# EAGLE design X8-Navboard (EAGLE 7.5.0)
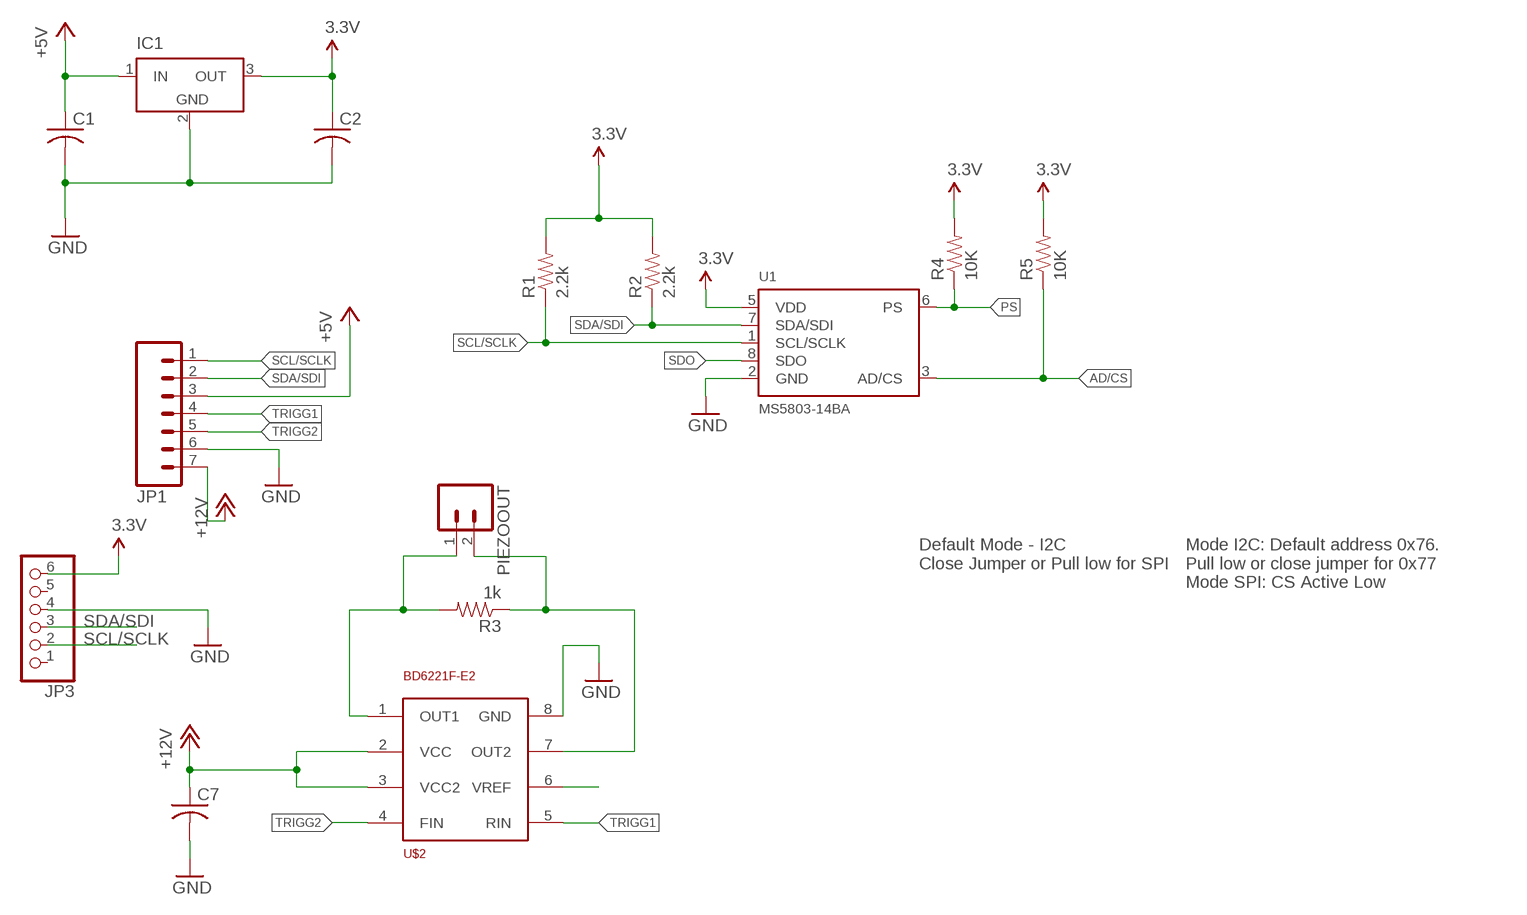
[diagram p0: schematic, sheet 1]

## Parts
C1  C-USC0603  [C0603]
C2  C-USC0603  [C0603]
C7  C-USC0603  [C0603]
IC1  LT1129CST5  [SOT223]
JP1  M07  [1X07]
JP3  PINHD-1X6  [1X06]
PIEZOOUT  M02LOCK_LONGPADS  [1X02_LOCK_LONGPADS]
R1  2.2k  2.2KOHM1/10W1%(0603)  [0603-RES]
R2  2.2k  2.2KOHM1/10W1%(0603)  [0603-RES]
R3  1k  2.2KOHM1/10W1%(0603)  [0603-RES]
R4  10K  10KOHM1/10W1%(0603)0603  [0603-RES]
R5  10K  10KOHM1/10W1%(0603)0603  [0603-RES]
U1  MS5803-14BA  [MS5803]
U$2  BD6221F-E2  [SOIC8]

## Nets
3.3V: C2.1 IC1.3(OUT) JP3.6 R1.2 R2.2 R4.2 R5.2 U1.5(VDD)
+5V: C1.1 IC1.1(IN) JP1.3
+12V: C7.1 JP1.7 U$2.2(VCC) U$2.3(VCC2)
AD/CS: R5.1 U1.3(AD/CS)
GND: C1.2 C2.2 C7.2 IC1.2(GND) JP1.6 JP3.4 U1.2(GND) U$2.8(GND)
N$1: PIEZOOUT.1 R3.2 U$2.1(OUT1)
N$2: PIEZOOUT.2 R3.1 U$2.7(OUT2)
N$9: U$2.6(VREF)
PS: R4.1 U1.6(PS)
SCL/SCLK: JP1.1 JP3.2 R1.1 U1.1(SCL/SCLK)
SDA/SDI: JP1.2 JP3.3 R2.1 U1.7(SDA/SDI)
SDO: U1.8(SDO)
TRIGG1: JP1.4 U$2.5(RIN)
TRIGG2: JP1.5 U$2.4(FIN)
Unconnected: JP3.1 JP3.5

## Notes on the sheet
- Default Mode - I2C
  Close Jumper or Pull low for SPI
- Mode I2C: Default address 0x76.
  Pull low or close jumper for 0x77
  Mode SPI: CS Active Low

## Power pins joined to a net without a drawn wire
GND: IC1.4(GND)

## Library data of the parts
C1 C2 C7 = resistor:C-US: CAPACITOR, American symbol
IC1 = linear-technology:LT1129CST5: VOLTAGE REGULATOR with shutdown; MPN: LT1129CST-5#PBF; OC_FARNELL: 1663375; OC_NEWARK: 57M2069
JP1 = SparkFun-Connectors:M07: Header 7 Standard 7-pin 0.1" header. Use with straight break away headers (SKU : PRT-00116), right angle break away headers (PRT-00553), swiss pins (PRT-00743), machine pins (PRT-00117), and female headers (PRT-00115). NOTES ON THE VARIANTS LOCK and LOCK_LONGPADS... This footprint was designed to help hold the alignment of a through-hole component (i.e. 7-pin header) while soldering it into place. You may notice that each hole has been shifted either up or down by 0.005 of an inch from it's more standard position (which is usually a perfectly straight line). This slight alteration caused the pins (the squares in the middle) to touch the edges of the holes. Because they are alternating, it causes a "brace" to hold the header in place. 0.005 has proven to be the perfect amount of "off-center" position when using our standard breakaway headers. Although looks a little odd when you look at the bare footprint, once you have a header in there, the alteration is very hard to notice. Also, if you push a header all the way into place, it is covered up entirely on the bottom side. This idea of altering the position of holes to aid alignment will be further integrated into the Sparkfun Library for other footprints. It can help hold any component with 3 or more connection pins.
JP3 = pinhead:PINHD-1X6: PIN HEADER
PIEZOOUT = SparkFun-Connectors:M02: Standard 2-pin 0.1" header. Use with - straight break away headers ( PRT-00116) - right angle break away headers (PRT-00553) - swiss pins (PRT-00743) - machine pins (PRT-00117) - female headers (PRT-00115) Molex polarized connector foot print use with: PRT-08233 with associated crimp pins and housings. 2.54_SCREWTERM for use with PRT-10571. 3.5mm Screw Terminal footprints for PRT-08084 5mm Screw Terminal footprints for use with PRT-08432
R1 R2 = SparkFun-Resistors:2.2KOHM1/10W1%(0603): RES-08272; PROD_ID: RES-08272
R3 = SparkFun-Resistors:2.2KOHM1/10W1%(0603): RES-08272; PROD_ID: RES-08272; VALUE: 2.2k
R4 R5 = SparkFun-Resistors:10KOHM1/10W1%(0603): RES-00824; PROD_ID: RES-00824
U1 = MS5803:MS5803-14BA; PROD_ID: IC-12111
U$2 = BNo-055:BD6221F-E2: IC MOTOR DRIVER Half Bridge

## Board
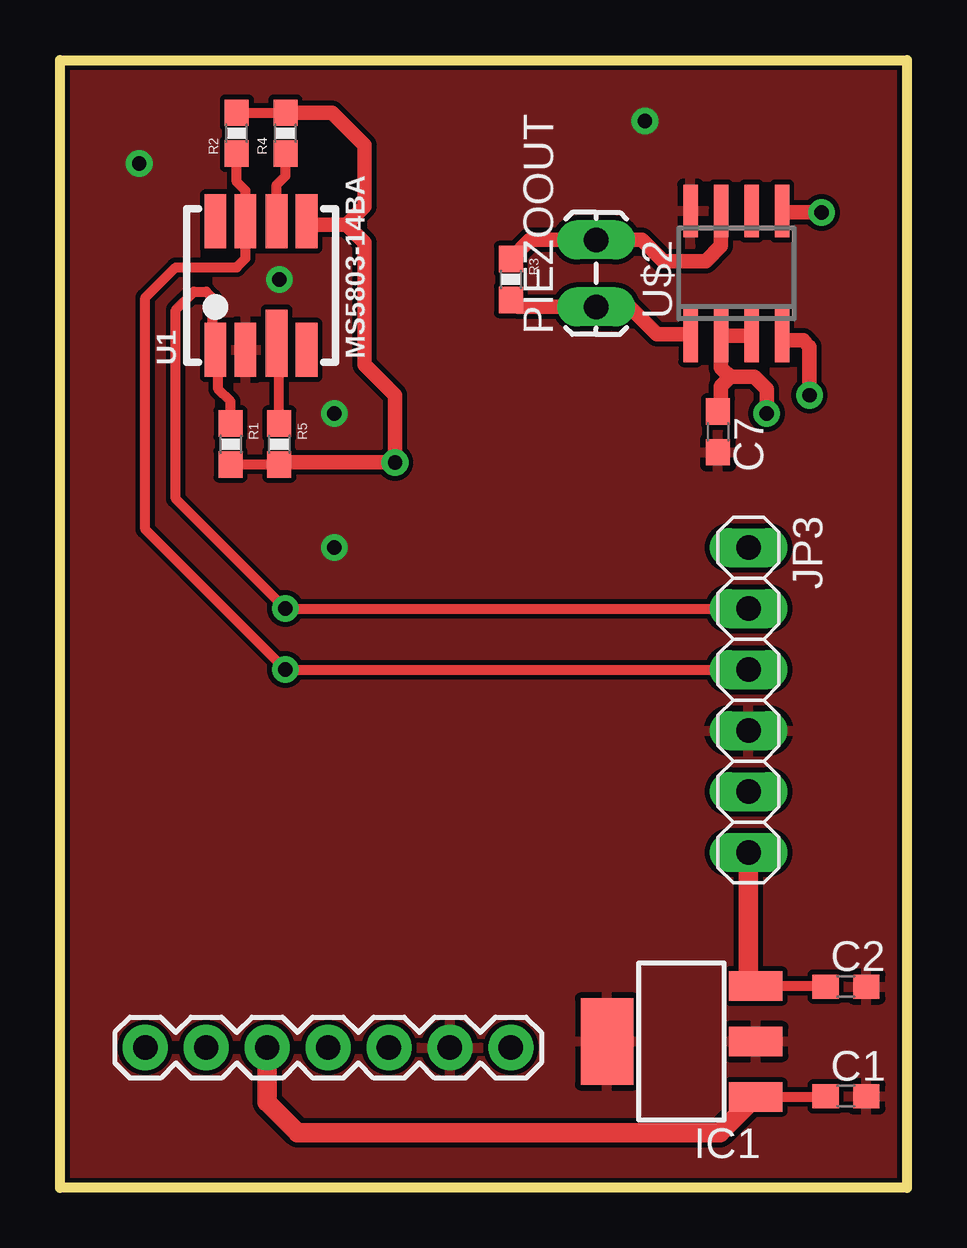
[diagram p1: board, top side]
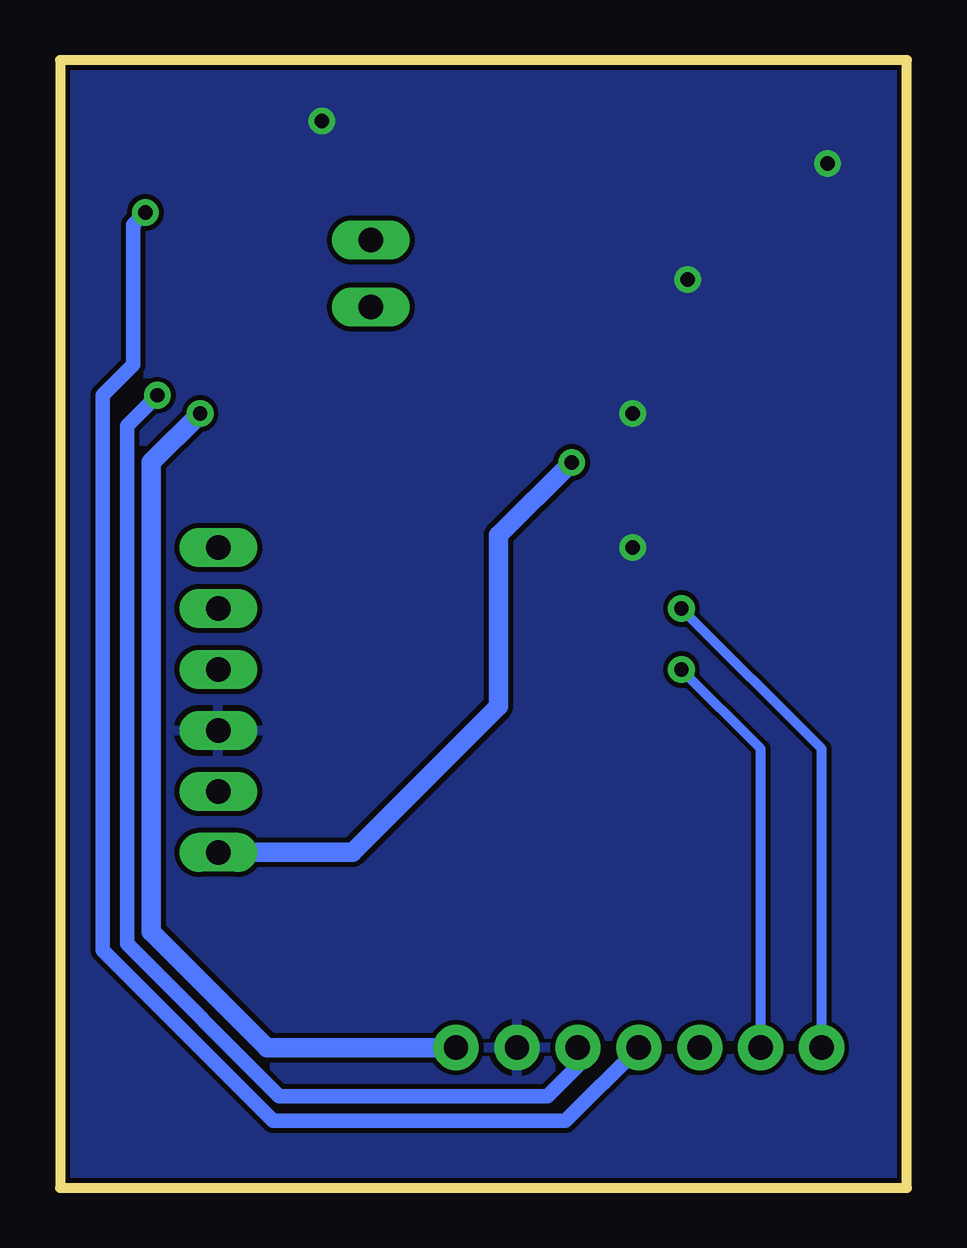
[diagram p2: board, bottom side, seen from below]

Size 35.31 x 46.99 mm. Coordinates in mm from the lower left corner, seen from the top.
Outline: 0,0 0,46.99 35.31,46.99 35.31,0 0,0
Copper layers (1*16): Top 0.035mm / dielectric 1.5mm / Bottom 0.035mm
Design rules "SparkFun-2-layer": minimum track width 7mil, minimum drill 15mil, track to track 8mil, track to pad 8mil, pad to pad 8mil, via to via 8mil, smd to smd 8mil, copper to edge 8mil, drill to drill 8mil, minimum pad ring 12mil, minimum via ring 10mil, stop-mask expansion 4mil, vias tented up to drill 20mil, thermal gap 10mil

### Footprints (pad centres in the part's own frame; a part is rotated, then mirrored left to right if it is on the bottom)
C0603 = smd 1.1 x 1: 1 -0.85,0; 2 0.85,0
SOT223 = smd 1.219 x 2.235: 1 -2.311,-3.099; 2 0,-3.099; 3 2.311,-3.099 | smd 3.6 x 2.2: 4 0,3.099
1X07 = drill 1.016 pad 1.88: 1 0,0; 2 2.54,0; 3 5.08,0; 4 7.62,0; 5 10.16,0; 6 12.7,0; 7 15.24,0
1X06 = drill 1.016 long: 1 -6.35,0; 2 -3.81,0; 3 -1.27,0; 4 1.27,0; 5 3.81,0; 6 6.35,0
1X02_LOCK_LONGPADS = drill 1.016 long: 1 -0.127,0; 2 2.667,0
0603-RES = smd 1.1 x 1: 1 -0.85,0; 2 0.85,0
MS5803 = smd 2.25 x 0.9: 1 -2.675,1.9; 2 -2.675,0.65; 4 -2.675,-1.9; 5 2.675,-1.9; 6 2.675,-0.65; 7 2.675,0.65; 8 2.675,1.9 | smd 2.8 x 0.9: 3 -2.4,-0.65
SOIC8 = smd 0.6 x 2.2: 1 -1.905,-2.6; 2 -0.635,-2.6; 3 0.635,-2.6; 4 1.905,-2.6; 5 1.905,2.6; 6 0.635,2.6; 7 -0.635,2.6; 8 -1.905,2.6

### Placement (x,y rotation side)
C1  32.77,3.81 0 top
C2  32.77,8.38 0 top
C7  27.43,31.5 270 top
IC1  25.91,6.1 90 top
JP1  3.56,5.84 0 top
JP3  28.7,20.32 270 top
PIEZOOUT  22.35,36.83 90 top
R1  7.11,30.99 270 top
R2  7.37,43.94 90 top
R3  18.8,37.85 270 top
R4  9.4,43.94 90 top
R5  9.14,30.99 270 top
U1  8.38,37.59 90 top
U$2  28.19,38.1 0 top

### Tracks (layer width: path | path; a pad name or v marks a point on that pad's centre or on a via)
3.3V  (via drill 0.6)
  Top 0.406: R1.2 R5.2 | R2.2 R4.2 | IC1.3 31.89,8.41 C2.1
  Top 0.61: R5.2 9.23,30.23 v13.97,30.23 13.97,33.02 12.7,34.29 12.7,39.37 11.94,40.13 | R4.2 11.34,44.79 12.7,43.43 12.7,40.89 11.94,40.13 | U1.5 10.42,40.13 11.94,40.13
  Top 0.813: JP3.6 28.7,8.71 IC1.3
  Bottom 0.813: JP3.6 23.11,13.97 17.02,20.07 17.02,27.18 v13.97,30.23
+5V
  Top 0.406: IC1.1 31.89,3.79 C1.1
  Top 0.813: JP1.3 8.64,3.56 9.91,2.29 27.51,2.29 IC1.1
+12V  (via drill 0.6)
  Top 0.61: U$2.3 U$2.2 27.56,34.16 27.94,33.78 | C7.1 27.56,32.47 27.56,33.4 27.94,33.78 | v29.46,32.26 29.46,33.27 28.96,33.78 27.94,33.78
  Bottom 0.813: JP1.7 26.67,5.84 31.5,10.67 31.5,30.23 v29.46,32.26
AD/CS
  Top 0.406: R5.1 9.14,35.19 U1.3
GND  (via drill 0.6)
  other vias: 3.3,42.67 9.14,37.85 11.43,32.26 11.43,26.67 24.38,44.45
  pour Top: 0,46.99 35.31,46.99 35.31,0 0,0
  pour Bottom: 0,46.99 35.31,46.99 35.31,0 0,0
N$1
  Top 0.61: R3.2 19.09,36.7 PIEZOOUT.1 23.75,36.7 24.89,35.56 26.23,35.56 U$2.1
N$2
  Top 0.61: R3.1 19.6,39.5 PIEZOOUT.2 24.26,39.5 25.15,38.61 26.92,38.61 27.56,39.24 U$2.7
PS
  Top 0.406: U1.6 9.03,41.8 9.4,42.16 R4.1
SCL/SCLK  (via drill 0.6)
  Top 0.406: R1.1 7.11,32.77 6.6,33.27 6.6,34.8 U1.1 6.35,35.05 6.35,37.08 6.1,37.34 5.59,37.34 4.83,36.58 4.83,28.7 v9.4,24.13 JP3.2
  Bottom 0.406: JP1.1 3.56,18.29 v9.4,24.13
SDA/SDI  (via drill 0.6)
  Top 0.406: R2.1 7.37,41.91 7.73,41.54 U1.7 7.73,38.72 7.37,38.35 4.83,38.35 3.56,37.08 3.56,27.43 v9.4,21.59 JP3.3
  Bottom 0.406: JP1.2 6.1,18.29 v9.4,21.59
TRIGG1  (via drill 0.6)
  Top 0.61: v31.75,40.64 30.16,40.64 U$2.5
  Bottom 0.61: JP1.4 14.22,2.79 26.42,2.79 33.53,9.91 33.53,33.02 32.26,34.29 32.26,40.13 v31.75,40.64
TRIGG2  (via drill 0.6)
  Top 0.61: v31.24,33.02 31.24,35.05 30.99,35.31 30.29,35.31 U$2.4
  Bottom 0.61: JP1.5 13.72,5.08 14.99,3.81 26.16,3.81 32.51,10.16 32.51,31.75 v31.24,33.02